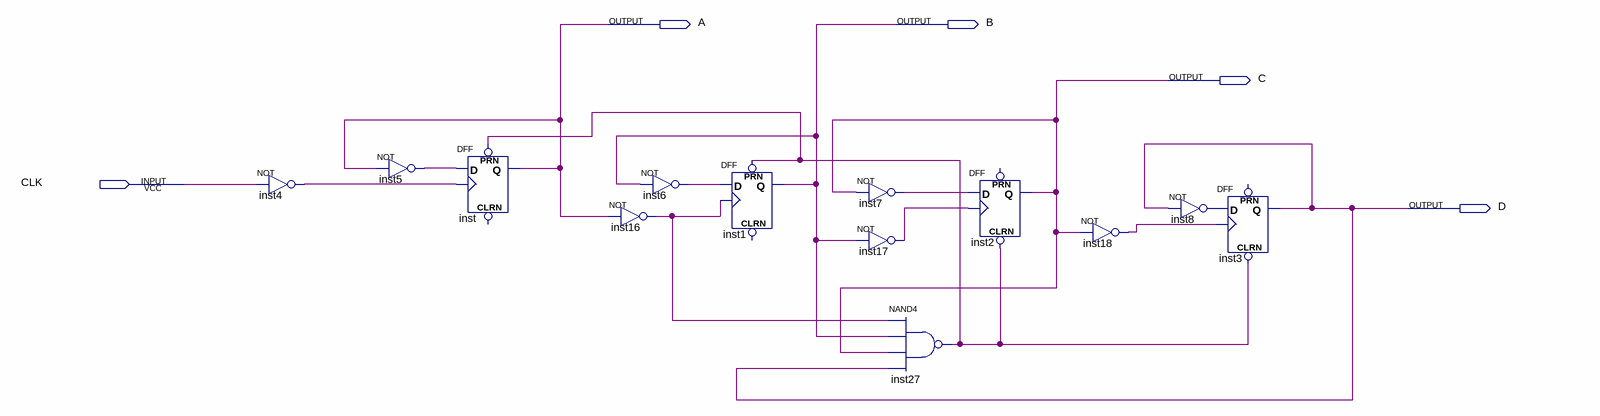
[diagram p0: schematic sheet]
// Quartus schematic ripple_4bit_UP_counter.bdf as structural Verilog: 13 symbols, 5 pins
module ripple_4bit_UP_counter (
  input  CLK,
  output A,
  output B,
  output C,
  output D
);

  wire inst4_out, inst5_out, inst6_out, inst7_out, inst8_out, inst16_out, inst17_out, inst18_out, inst27_out;

  not inst4 (inst4_out, CLK);
  not inst5 (inst5_out, A);
  DFF inst (.CLK(inst4_out), .D(inst5_out), .PRN(inst27_out), .Q(A));  // open: CLRN
  not inst6 (inst6_out, B);
  not inst16 (inst16_out, A);
  DFF inst1 (.CLK(inst16_out), .D(inst6_out), .PRN(inst27_out), .Q(B));  // open: CLRN
  not inst7 (inst7_out, C);
  not inst17 (inst17_out, B);
  nand inst27 (inst27_out, inst16_out, B, C, D);
  DFF inst2 (.CLRN(inst27_out), .CLK(inst17_out), .D(inst7_out), .Q(C));  // open: PRN
  not inst18 (inst18_out, C);
  not inst8 (inst8_out, D);
  DFF inst3 (.CLRN(inst27_out), .CLK(inst18_out), .D(inst8_out), .Q(D));  // open: PRN
endmodule
